# Altium schematic sheet Sheet1.SchDoc
size A4; SheetNumber: 1; SheetTotal: 1
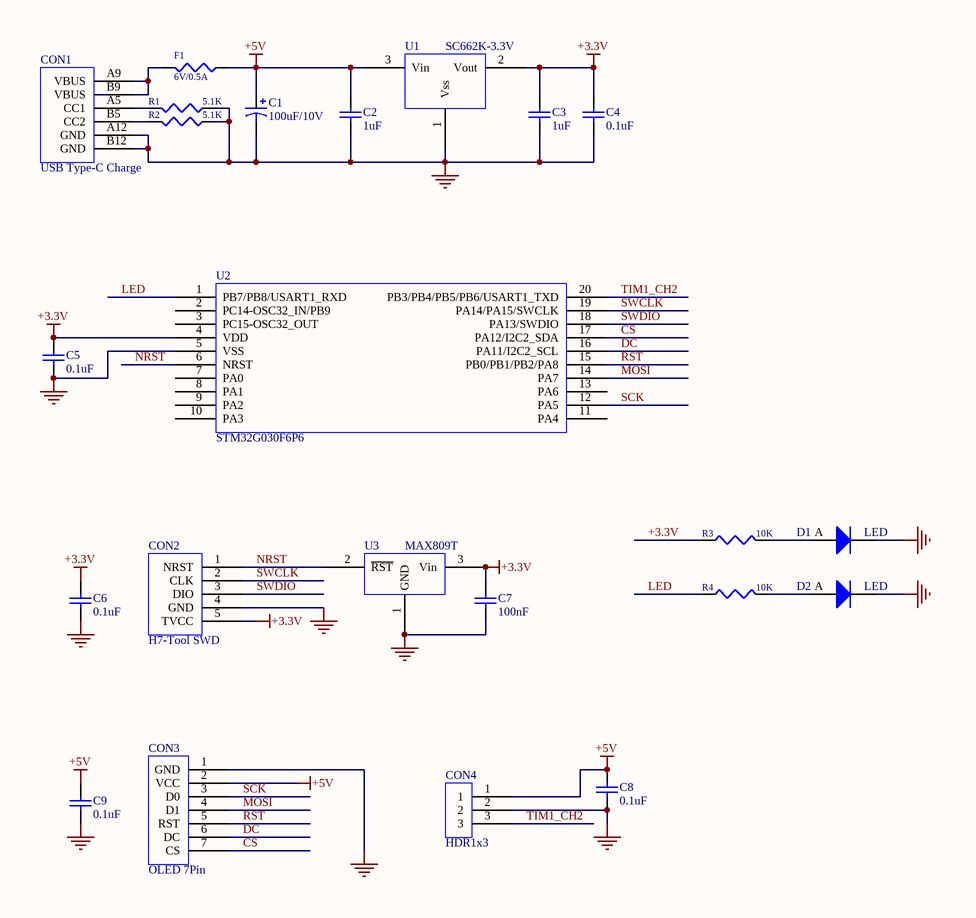
[diagram p0: Sheet1.SchDoc]

## Parts
C1  value 100uF/10V  [CM C(5*5.4)]  (hidden comment: Cap Pol1)
C2  1uF  [0603_C]
C3  1uF  [0603_C]
C4  0.1uF  [0603_C]
C5  0.1uF  [0603_C]
C6  0.1uF  [0603_C]
C7  100nF  [0603_C]
C8  0.1uF  [0603_C]
C9  0.1uF  [0603_C]
CON1  USB Type-C Charge  [Type-C_4charge]
CON2  H7-Tool SWD  [hdr1x5]
CON3  OLED 7Pin  [0.96 OLED SPI]
CON4  HDR1x3  [XH2.54-LI-3P]
D1  LED  [0603_LED_S1]
D2  LED  [0603_LED_S1]
F1  6V/0.5A  [0603_L]
R1  5.1K  [0603_R]
R2  5.1K  [0603_R]
R3  10K  [0603_R]
R4  10K  [0603_R]
U1  SC662K-3.3V  [SOT-23(SOT-23-3)]
U2  STM32G030F6P6  [TSSOP-20]
U3  MAX809T  [SOT-23(SOT-23-3)]

## Nets
+3.3V: C3.2 C4.2 C5.2 C6.2 C7.1 CON2.5(TVCC) R3.2(BOT) U1.2(Vout) U2.4(VDD) U3.3(Vin)
+5V: C1.1 C2.2 C8.2 C9.2 CON3.2(VCC) CON4.1 F1.2(BOT) U1.3(Vin)
GND: C1.2 C2.1 C3.1 C4.1 C5.1 C6.1 C7.2 C8.1 C9.1 CON1.A12(GND) CON1.B12(GND) CON2.4(GND) CON3.1(GND) CON4.2 D1.K D2.K R1.2(BOT) R2.2(BOT) U1.1(Vss) U2.5(VSS) U3.1(GND)
CS: CON3.7(CS) U2.17(PA12/I2C2_SDA)
DC: CON3.6(DC) U2.16(PA11/I2C2_SCL)
LED: R4.2(BOT) U2.1(PB7/PB8/USART1_RXD)
MOSI: CON3.4(D1) U2.14(PA7)
NRST: CON2.1(NRST) U2.6(NRST) U3.2(~{RST})
RST: CON3.5(RST) U2.15(PB0/PB1/PB2/PA8)
SCK: CON3.3(D0) U2.12(PA5)
SWCLK: CON2.2(CLK) U2.19(PA14/PA15/SWCLK)
SWDIO: CON2.3(DIO) U2.18(PA13/SWDIO)
TIM1_CH2: CON4.3 U2.20(PB3/PB4/PB5/PB6/USART1_TXD)
NetCON1_A5: CON1.A5(CC1) R1.1(TOP)
NetCON1_A9: CON1.A9(VBUS) CON1.B9(VBUS) F1.1(TOP)
NetCON1_B5: CON1.B5(CC2) R2.1(TOP)
NetD1_A: D1.A R3.1(TOP)
NetD2_A: D2.A R4.1(TOP)

Not connected (* = marked no-connect by the designer): U2 2(PC14-OSC32_IN/PB9) 3(PC15-OSC32_OUT) 7(PA0) 8(PA1) 9(PA2) 10(PA3) 11(PA4) 13(PA6)

## Library data of the parts
C1 = Cap Pol1: Polarized Capacitor (Radial); Published: 8-Jun-2000; LatestRevisionDate: 17-Jul-2002; LatestRevisionNote: Re-released for DXP Platform.; PackageReference: RB7.6-15; Publisher: Altium Limited; PackageDescription: Polarized Capacitor (Radial); 2 Leads
C2-C9 = 0603 100nF (104) 10% 50V: 贴片电容; ComponentLink1Description: 供应商链接; ComponentLink1URL: http://www.szlcsc.com/product/details_15331.html; Package: 0603; Supplier: LC; SuppliersPartNumber: C14663
D1 D2 = Diode: 二极管; Notepad: 1N4007 4007 编号C2464 已经停售, 使用新物料编号C95872; ComponentLink1Description: 供应商链接; ComponentLink1URL: http://www.szlcsc.com/product/details_2841.html; Package: SMA(DO-214AC); Supplier: LC; SuppliersPartNumber: C95872
F1 R1-R4 = RES: Resistor
U1 = SC662K-3.3V: Vinmax=6v;Ioutmax=250mA; 1.8V LDO
U3 = MAX809T: 3.08v